# Altium schematic sheet Current-Sense-Sheet.SchDoc
size 420 x 297 mm; SheetNumber: 1; SheetTotal: 6
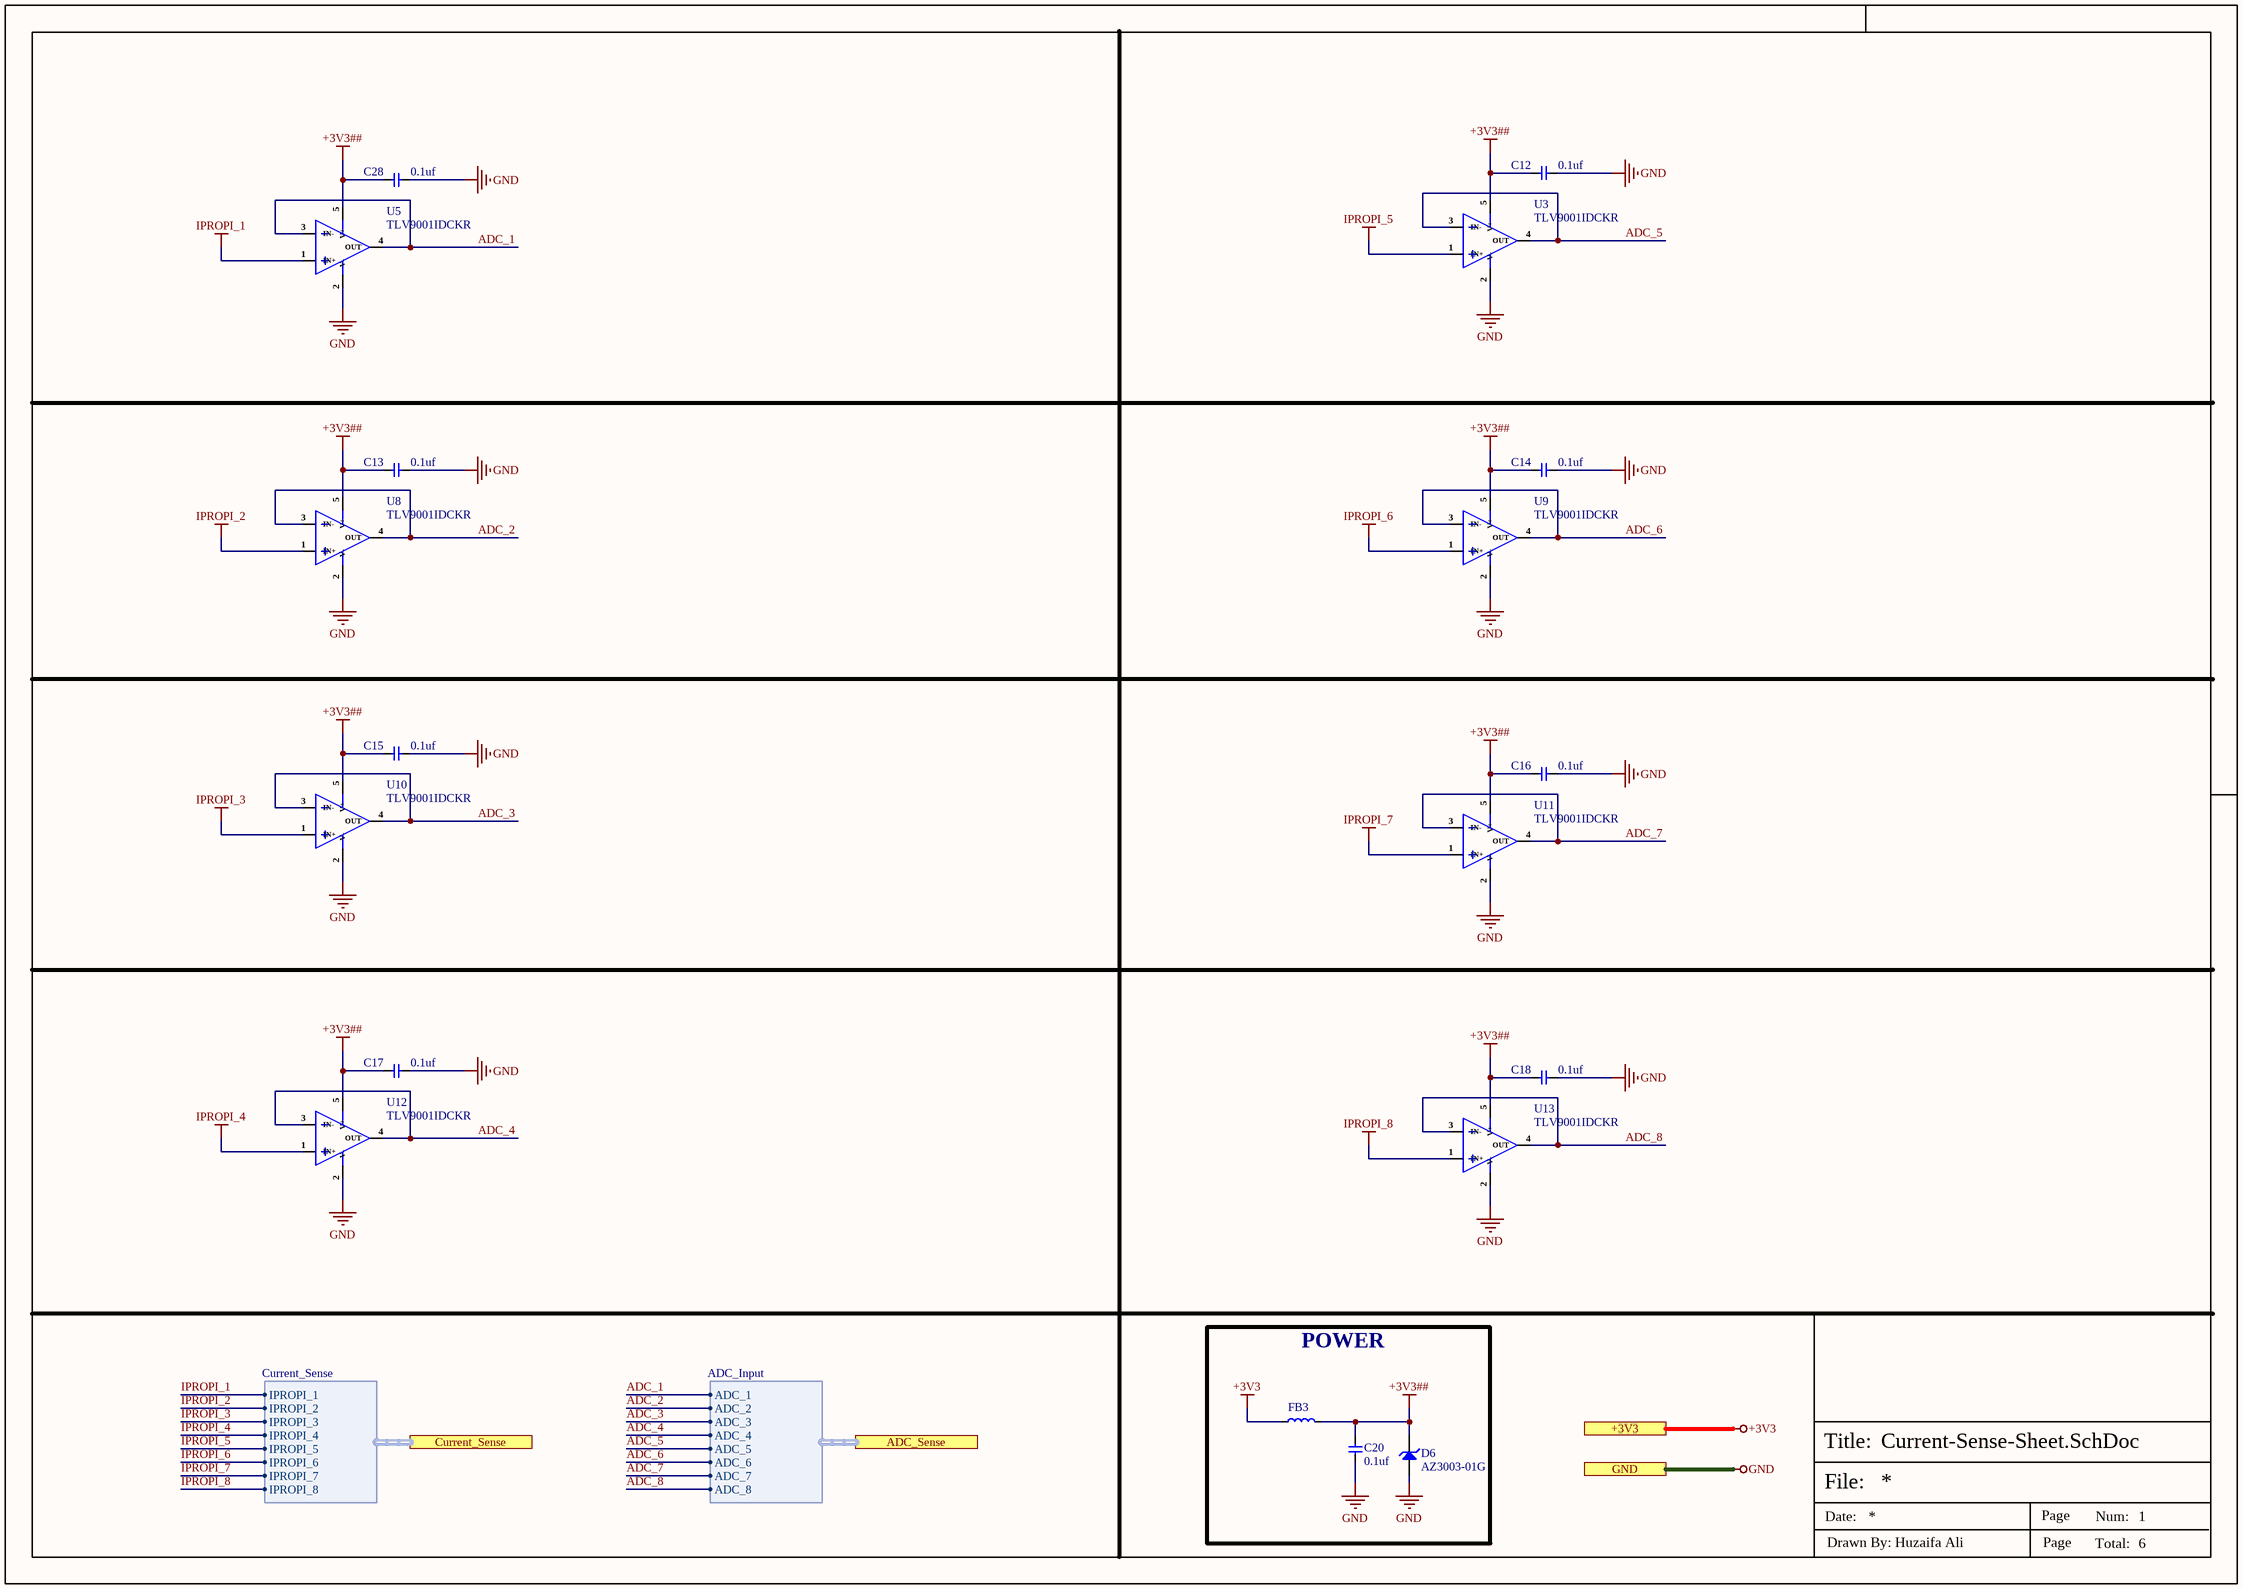
[diagram p0: Current-Sense-Sheet.SchDoc]

## Parts
C12  0.1uf  [Cap-0402]
C13  0.1uf  [Cap-0402]
C14  0.1uf  [Cap-0402]
C15  0.1uf  [Cap-0402]
C16  0.1uf  [Cap-0402]
C17  0.1uf  [Cap-0402]
C18  0.1uf  [Cap-0402]
C20  0.1uf  [Cap-0402]
C28  0.1uf  [Cap-0402]
D6  AZ3003-01G  [SOD-123]
FB3  BLM15PG100SN1D  [IND-0402]  (value not drawn)
U3  TLV9001IDCKR  [SC-70-5]
U5  TLV9001IDCKR  [SC-70-5]
U8  TLV9001IDCKR  [SC-70-5]
U9  TLV9001IDCKR  [SC-70-5]
U10  TLV9001IDCKR  [SC-70-5]
U11  TLV9001IDCKR  [SC-70-5]
U12  TLV9001IDCKR  [SC-70-5]
U13  TLV9001IDCKR  [SC-70-5]

## Blocks framed on the sheet
POWER: C20 D6 FB3

## Ports
+3V3 (see Top-Sheet[2B], CAN-Sheet[5D], Connector-Sheet[5D], Power-Sheet[4D]), ADC_Sense (harness ADC_Input, see Top-Sheet[2B], Connector-Sheet[2D]), Current_Sense (harness Current_Sense, see Top-Sheet[2B], Connector-Sheet[3D]), GND (see Top-Sheet[2B], CAN-Sheet[5D], Connector-Sheet[5D], Power-Sheet[4D])

## Harnesses
Current_Sense: IPROPI_1, IPROPI_2, IPROPI_3, IPROPI_4, IPROPI_5, IPROPI_6, IPROPI_7, IPROPI_8
ADC_Input: ADC_1, ADC_2, ADC_3, ADC_4, ADC_5, ADC_6, ADC_7, ADC_8

## Nets
+3V3: FB3.1 ; port +3V3
+3V3##: C12.1 C13.1 C14.1 C15.1 C16.1 C17.1 C18.1 C20.2 C28.1 D6.2(K) FB3.2 U3.5(V+) U5.5(V+) U8.5(V+) U9.5(V+) U10.5(V+) U11.5(V+) U12.5(V+) U13.5(V+)
GND: C12.2 C13.2 C14.2 C15.2 C16.2 C17.2 C18.2 C20.1 C28.2 D6.1(A) U3.2(V-) U5.2(V-) U8.2(V-) U9.2(V-) U10.2(V-) U11.2(V-) U12.2(V-) U13.2(V-) ; port GND
IPROPI_1: U5.1(IN+) ; port Current_Sense.IPROPI_1
IPROPI_2: U8.1(IN+) ; port Current_Sense.IPROPI_2
IPROPI_3: U10.1(IN+) ; port Current_Sense.IPROPI_3
IPROPI_4: U12.1(IN+) ; port Current_Sense.IPROPI_4
IPROPI_5: U3.1(IN+) ; port Current_Sense.IPROPI_5
IPROPI_6: U9.1(IN+) ; port Current_Sense.IPROPI_6
IPROPI_7: U11.1(IN+) ; port Current_Sense.IPROPI_7
IPROPI_8: U13.1(IN+) ; port Current_Sense.IPROPI_8
ADC_1: U5.3(IN-) U5.4(OUT) ; port ADC_Sense.ADC_1
ADC_2: U8.3(IN-) U8.4(OUT) ; port ADC_Sense.ADC_2
ADC_3: U10.3(IN-) U10.4(OUT) ; port ADC_Sense.ADC_3
ADC_4: U12.3(IN-) U12.4(OUT) ; port ADC_Sense.ADC_4
ADC_5: U3.3(IN-) U3.4(OUT) ; port ADC_Sense.ADC_5
ADC_6: U9.3(IN-) U9.4(OUT) ; port ADC_Sense.ADC_6
ADC_7: U11.3(IN-) U11.4(OUT) ; port ADC_Sense.ADC_7
ADC_8: U13.3(IN-) U13.4(OUT) ; port ADC_Sense.ADC_8

## Notes on the sheet
- File:
- Title:
- Date:
- Page
- Num:
- Total:
- Drawn By: Huzaifa Ali

## Library data of the parts
C12-C18 C20 C28 = GRM155R62A104KE14D: CAP CER 0.1UF 100V X5R 0402; Manufacturer: Murata; Capacitance: 100nF; Tolerance: 10%; Item Type: Capacitor; Supplier 1: Arrow Electronics; Manufacturer Part Number: GRM155R62A104KE14D; RoHS: Yes; Category: Ceramic Capacitors; Stock 1: 870000; Pricing 1: 10000=0.00500, 20000=0.00410, 30000=0.00390, 50000=0.00370, 100000=0.00300 (USD); Mount: Surface Mount; Case/Package: 0402; Case Code (Metric): 1005; Case Code (Imperial): 0402; Weight: 0.000212oz; Min Operating Temperature: -55°C; Max Operating Temperature: 85°C; Packaging: Tape and Reel; Voltage Rating: 100V; Dielectric: X5R; Termination: SMD/SMT; Voltage Rating (DC): 100V; Package Quantity: 10000; Series: GRM; Length: 0.039inch; Width: 0.02inch; Height: 0.5mm; Thickness: 0.022inch; Reach SVHC Compliant: Yes; Lead Free: Lead Free; RoHS Compliant: Yes; ComponentLink1URL: http://www.farnell.com/datasheets/2079151.pdf?src-supplier=Farnell; ComponentLink1Description: http://www.farnell.com/datasheets/2079151.pdf?src-supplier=Farnell; ComponentLink2URL: http://www.mouser.com/ds/2/281/c02e-2905.pdf?src-supplier=Mouser; ComponentLink2Description: http://www.mouser.com/ds/2/281/c02e-2905.pdf?src-supplier=Mouser; ComponentLink3URL: http://www.farnell.com/datasheets/2079151.pdf?src-supplier=Element14; ComponentLink3Description: http://www.farnell.com/datasheets/2079151.pdf?src-supplier=Element14; ComponentLink4URL: http://search.murata.co.jp/Ceramy/image/img/A01X/G101/ENG/GRM155R62A104KE14-01.pdf?src-supplier=Digi-Key; ComponentLink4Description: http://search.murata.co.jp/Ceramy/image/img/A01X/G101/ENG/GRM155R62A104KE14-01.pdf?src-supplier=Digi-Key; ComponentLink5URL: http://www.farnell.com/datasheets/2079151.pdf?src-supplier=Newark; ComponentLink5Description: http://www.farnell.com/datasheets/2079151.pdf?src-supplier=Newark; Supplier Part Number 1: GRM155R62A104KE14D; LCSC Part Number: C162178
D6 = AZ3003-01G: TVS SURGE PROTECTOR 1-CH 3.3V; Manufacturer: Amazing; Item Type: Diode; Manufacturer Part Number: AZ3003-01G; Package: SOD-123; LCSC Part Number: -; ComponentLink1Description: Digikey; ComponentLink1URL: https://www.digikey.com/en/products/detail/amazing/AZ3003-01G/16615352?s=N4IgTCBcDaIIIC0DMAGFSC0KCMBxEAugL5A
FB3 = BLM15PG100SN1D: FERRITE BEAD 10 OHM 0402 1LN; Manufacturer: Murata; Material: Steel; Impedance: 10R; Current Rating: 1A; Number of Lines: 1; DC Resistance (DCR): 25mR; Shielding: Unshielded; Tolerance: 25%; Test Frequency: 100MHz; DC Resistance-Max: 50mR; Supplier 1: Arrow Electronics; Manufacturer Part Number: BLM15PG100SN1D; RoHS: Yes; Category: Ferrite Beads and Chips; Stock 1: 9684; Pricing 1: 1=0.10900, 10=0.06930, 25=0.05030, 50=0.04970, 100=0.03510, 250=0.03470, 500=0.03030, 1000=0.03000, 3000=0.02970, 6000=0.02640 (USD); Case/Package: 0402; Number of Pins: 2; Core Material: Ferrite; Case Code (Metric): 1005; Case Code (Imperial): 0402; Min Operating Temperature: -55°C; Max Operating Temperature: 125°C; Packaging: Tape and Reel; Number of Circuits: 1; Package Quantity: 1; Max Current Rating: 1A; Termination: SMD/SMT; Max DC Current: 1A; Series: BLM15PG; Length: 1mm; Width: 0.5mm; Height: 0.5mm; Depth: 0.55mm; REACH SVHC: No SVHC; Lead Free: Lead Free; RoHS Compliant: Yes; ComponentLink1URL: https://datasheet.ciiva.com/41449/001172209-da-01-en-drossel-0402-10r-1-0x0-5mm-10000st-41449496.pdf?src-supplier=Conrad; ComponentLink1Description: https://datasheet.ciiva.com/41449/001172209-da-01-en-drossel-0402-10r-1-0x0-5mm-10000st-41449496.pdf?src-supplier=Conrad; ComponentLink2URL: https://datasheet.ciiva.com/46423/1851892-46423898.pdf?src-supplier=Element14; ComponentLink2Description: https://datasheet.ciiva.com/46423/1851892-46423898.pdf?src-supplier=Element14; ComponentLink3URL: https://datasheet.ciiva.com/6211/l0110e-6211726.pdf?src-supplier=Digi-Key; ComponentLink3Description: https://datasheet.ciiva.com/6211/l0110e-6211726.pdf?src-supplier=Digi-Key; Supplier Part Number 1: BLM15PG100SN1D; LCSC Part Number: C85823; Item Type: Ferrite Bead
U3 U5 U8-U13 = TLV9001IDCKR: IC CMOS 1 CIRCUIT SC70-5; Manufacturer: Texas Instruments; Number of Channels: 1; Slew Rate: 2V/µs; Gain Bandwidth Product: 1MHz; Input Bias Current: 5pA; Input Offset Voltage (Vos): 400uV; Operating Supply Current: 60uA; Output Current per Channel: 40mA; Supplier: Mouser; Supplier Part Number: 595-TLV9001IDCKR; Manufacturer Part Number: TLV9001IDCKR; RoHS: Yes; Item Type: IC; Stock: 13115; Pricing: 1=0.47, 10=0.348, 50=0.348, 100=0.194, 1000=0.146, 10000=0.117 (USD); Mounting Technology: Surface Mount; Min Operating Temperature: -40°C; Max Operating Temperature: 125°C; Packaging: Cut Tape; Number of Circuits: 1; Series: -; RoHS Compliant: Yes; ComponentLink1URL: http://www.ti.com/lit/ds/symlink/tlv9001.pdf?src-supplier=Digikey; ComponentLink1Description: http://www.ti.com/lit/ds/symlink/tlv9001.pdf?src-supplier=Digikey; LCSC Part Number: C398362